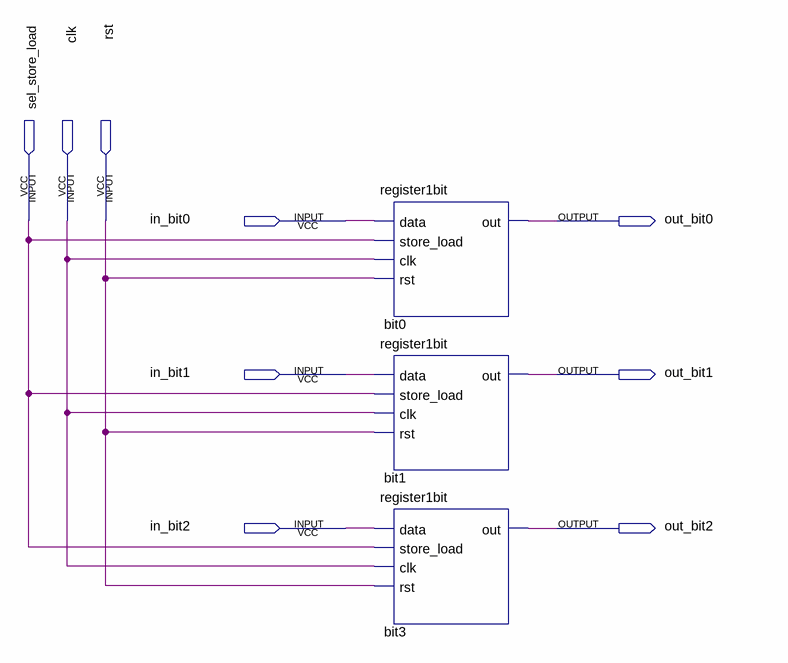
[diagram p0: schematic sheet]
// Quartus schematic register3bit.bdf as structural Verilog: 3 symbols, 9 pins
module register3bit (
  input  sel_store_load,
  input  clk,
  input  rst,
  input  in_bit0,
  input  in_bit1,
  input  in_bit2,
  output out_bit0,
  output out_bit1,
  output out_bit2
);

  register1bit bit0 (.data(in_bit0), .store_load(sel_store_load), .clk(clk), .rst(rst), .out(out_bit0));
  register1bit bit1 (.data(in_bit1), .store_load(sel_store_load), .clk(clk), .rst(rst), .out(out_bit1));
  register1bit bit3 (.data(in_bit2), .store_load(sel_store_load), .clk(clk), .rst(rst), .out(out_bit2));
endmodule
